# Altium schematic sheet LED.SchDoc: LEDs
size A; Revision: 1
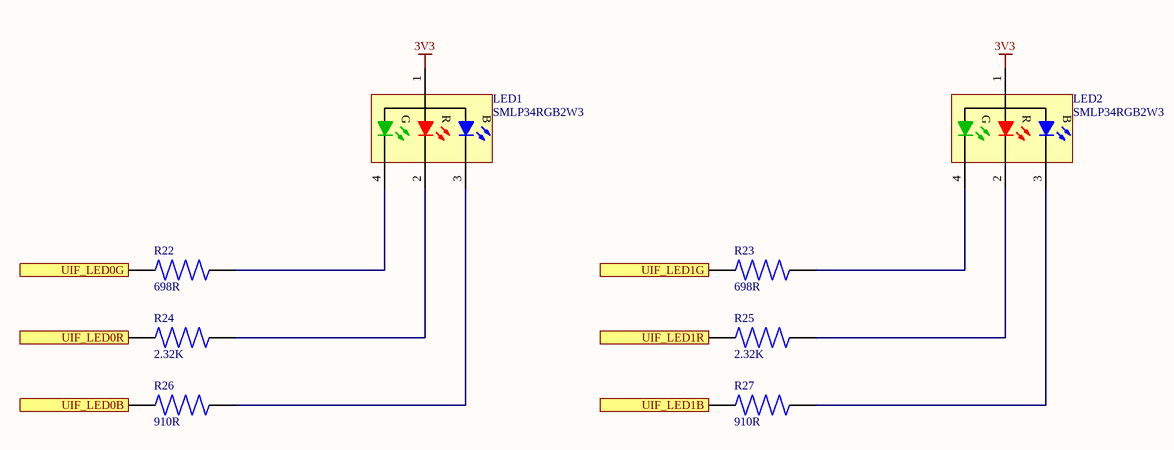
[diagram p0: LED.SchDoc]

## Parts
LED1  SMLP34RGB2W3  [ROHM-SMLP34-4_V]
LED2  SMLP34RGB2W3  [ROHM-SMLP34-4_V]
R22  698R  [R0603 Vishay]
R23  698R  [R0603 Vishay]
R24  2.32K  [R0805 Vishay]
R25  2.32K  [R0805 Vishay]
R26  910R  [R0402 Vishay]
R27  910R  [R0402 Vishay]

## Ports
UIF_LED0B (in), UIF_LED0G (in), UIF_LED0R (in), UIF_LED1B (in), UIF_LED1G (in), UIF_LED1R (in)

## Nets
3V3: LED1.1(A) LED2.1(A)
UIF_LED0B: R26.1 ; port UIF_LED0B
UIF_LED0G: R22.1 ; port UIF_LED0G
UIF_LED0R: R24.1 ; port UIF_LED0R
UIF_LED1B: R27.1 ; port UIF_LED1B
UIF_LED1G: R23.1 ; port UIF_LED1G
UIF_LED1R: R25.1 ; port UIF_LED1R
NetLED1_2: LED1.2(R) R24.2
NetLED1_3: LED1.3(B) R26.2
NetLED1_4: LED1.4(G) R22.2
NetLED2_2: LED2.2(R) R25.2
NetLED2_3: LED2.3(B) R27.2
NetLED2_4: LED2.4(G) R23.2

## Library data of the parts
LED1 LED2 = SMLP34RGB2W3: PICOLED-RGB LED, 5 mA, -40 to 85 degC, 4-Pin 1 x 1 x 0.25 mm SMD, RoHS, Tape and Reel; Manufacturer: ROHM Semiconductor; VR(RGB): 5 V; VF(Blue): 3.2 V Typ.; VF(Green): 3.3 V Typ.; IF(RGB): 5 mA; IR(RGB): 10 uA Max.; VF(Red): 2.2 V Typ.; ComponentLink1Description: Manufacturer URL; ComponentLink2Description: Datasheet; PartNumber: SMLP34RGB2W3; DatasheetVersion: Rev. G; Mounting Technology: Surface Mount; ComponentLink1URL: http://www.rohm.com/; Packing: Tape and Reel; RoHS: TRUE; Temperature Range: -40 to 85 degC; PackageReference: SMLP34; PackageDescription: 4-Pin SMD, Body 1 x 1 mm, Pitch 0.85 mm; ComponentLink2URL: http://rohmfs.rohm.com/en/products/databook/datasheet/opto/led/chip_multi/smlp34.pdf
R22 R23 = CRCW0201698RFNED: RES SMD 698 OHM 1% 1/20W 0201; Manufacturer: Vishay; Power Rating: 50mW; Voltage Rating: 30V; Temperature Coefficient: 200ppm/°C; Supplier 1: Digi-Key; Manufacturer Part Number: CRCW0201698RFNED; RoHS: Yes; Category: Chip SMD Resistors; Stock 1: 10000; Pricing 1: 1=0.10000, 10=0.05700, 100=0.02300, 1000=0.01034, 2500=0.00897, 5000=0.00741 (USD); Case/Package: 0201; Case Code (Metric): 0603; Case Code (Imperial): 0201; Contact Plating: Tin; Min Operating Temperature: -55°C; Max Operating Temperature: 155°C; Packaging: Tape and Reel; Resistance: 698R; Tolerance: 1%; Package Quantity: 10000; Resistor Type: Thick Film; Number of Terminations: 2; Max Power Dissipation: 50mW; Voltage Rating (DC): 30V; Length: 0.024inch; Width: 0.012inch; Height: 0.011inch; Radiation Hardening: No; REACH SVHC: Unknown; Lead Free: Lead Free; ComponentLink1URL: https://datasheet.ciiva.com/2577/crcw0201e3-2577171.pdf?src-supplier=Digi-Key; ComponentLink1Description: https://datasheet.ciiva.com/2577/crcw0201e3-2577171.pdf?src-supplier=Digi-Key; ComponentLink2URL: https://datasheet.ciiva.com/8922/crcw0201e3-8922646.pdf?src-supplier=Avnet; ComponentLink2Description: https://datasheet.ciiva.com/8922/crcw0201e3-8922646.pdf?src-supplier=Avnet; ComponentLink3URL: https://datasheet.ciiva.com/7672/1719906-7672440.pdf?src-supplier=Element14; ComponentLink3Description: https://datasheet.ciiva.com/7672/1719906-7672440.pdf?src-supplier=Element14; ComponentLink4URL: https://datasheet.ciiva.com/7672/1719906-7672441.pdf?src-supplier=Element14; ComponentLink4Description: https://datasheet.ciiva.com/7672/1719906-7672441.pdf?src-supplier=Element14; ComponentLink5URL: https://datasheet.ciiva.com/22674/1700795-22674828.pdf?src-supplier=Element14; ComponentLink5Description: https://datasheet.ciiva.com/22674/1700795-22674828.pdf?src-supplier=Element14; Supplier Part Number 1: 541-CRCW0201698RFNEDCT-ND
R24 R25 = CRCW08052K32FKEA: VISHAY - CRCW08052K32FKEA - RES, THICK FILM, 2K32, 1%, 0.125W, 0805; Resistance: 2.32kR; Temperature Coefficient: 100ppm/°C; Max Power Dissipation: 125mW; Voltage Rating: 150V; Supplier 1: Digi-Key; Manufacturer: Vishay; Manufacturer Part Number: CRCW08052K32FKEA; RoHS: Yes; Category: Chip SMD Resistors; Stock 1: 20040; Pricing 1: 1=0.10000, 10=0.05700, 100=0.02310, 1000=0.01039, 2500=0.00902 (USD); Case/Package: 0805; Number of Pins: 2; Contact Plating: Tin; Weight: 0.000194oz; Case Code (Imperial): 0805; Case Code (Metric): 2012; Min Operating Temperature: -55°C; Max Operating Temperature: 155°C; Tolerance: 1%; Resistor Type: Thick Film; Packaging: Tape and Reel; Number of Terminations: 2; Package Quantity: 10; Features: Automotive AEC-Q200; Power Rating: 125mW; Termination: SMD/SMT; Voltage Rating (DC): 150V; Length: 2mm; Width: 1.25mm; Height: 0.02inch; Depth: 1.25mm; Radiation Hardening: No; Lead Free: Lead Free; REACH SVHC: Unknown; Military Standard: Not; ComponentLink1URL: https://datasheet.ciiva.com/16435/dcrcwe3-16435909.pdf?src-supplier=Future+Electronics; ComponentLink1Description: https://datasheet.ciiva.com/16435/dcrcwe3-16435909.pdf?src-supplier=Future+Electronics; ComponentLink2URL: https://datasheet.ciiva.com/3258/dcrcwe3-3258438.pdf?src-supplier=Avnet; ComponentLink2Description: https://datasheet.ciiva.com/3258/dcrcwe3-3258438.pdf?src-supplier=Avnet; ComponentLink3URL: https://datasheet.ciiva.com/3258/dcrcwe3-3258439.pdf?src-supplier=Avnet; ComponentLink3Description: https://datasheet.ciiva.com/3258/dcrcwe3-3258439.pdf?src-supplier=Avnet; ComponentLink4URL: https://datasheet.ciiva.com/2525/dcrcwe3-2525755.pdf?src-supplier=Digi-Key; ComponentLink4Description: https://datasheet.ciiva.com/2525/dcrcwe3-2525755.pdf?src-supplier=Digi-Key; ComponentLink5URL: https://datasheet.ciiva.com/2525/dcrcwe3-2525756.pdf?src-supplier=Digi-Key; ComponentLink5Description: https://datasheet.ciiva.com/2525/dcrcwe3-2525756.pdf?src-supplier=Digi-Key; ComponentLink6URL: https://datasheet.ciiva.com/2525/dcrcwe3-2525757.pdf?src-supplier=Digi-Key; ComponentLink6Description: https://datasheet.ciiva.com/2525/dcrcwe3-2525757.pdf?src-supplier=Digi-Key; ComponentLink7URL: https://datasheet.ciiva.com/7670/1697337-7670286.pdf?src-supplier=Element14; ComponentLink7Description: https://datasheet.ciiva.com/7670/1697337-7670286.pdf?src-supplier=Element14; ComponentLink8URL: https://datasheet.ciiva.com/17201/dcrcwe3-17201132.pdf?src-supplier=Avnet+Europe; ComponentLink8Description: https://datasheet.ciiva.com/17201/dcrcwe3-17201132.pdf?src-supplier=Avnet+Europe; ComponentLink9URL: https://datasheet.ciiva.com/7670/1697337-7670285.pdf?src-supplier=Element14; ComponentLink9Description: https://datasheet.ciiva.com/7670/1697337-7670285.pdf?src-supplier=Element14; ComponentLink10URL: https://datasheet.ciiva.com/22675/1825492-22675197.pdf?src-supplier=Element14; ComponentLink10Description: https://datasheet.ciiva.com/22675/1825492-22675197.pdf?src-supplier=Element14; ComponentLink11URL: https://datasheet.ciiva.com/16769/70201119-16769374.pdf?src-supplier=Allied+Electronics; ComponentLink11Description: https://datasheet.ciiva.com/16769/70201119-16769374.pdf?src-supplier=Allied+Electronics; Supplier Part Number 1: 541-2.32KCCT-ND
R26 R27 = CRCW0402910RFKED: Res Thick Film 0402 910 Ohm 1% 0.063W(1/16W) ±100ppm/C Pad SMD Automotive T/R; Manufacturer: Vishay; Temperature Coefficient: 100ppm/°C; Power Rating: 63mW; Voltage Rating: 50V; Supplier 1: Digi-Key; Manufacturer Part Number: CRCW0402910RFKED; RoHS: Yes; Category: Chip SMD Resistors; Stock 1: 32719; Pricing 1: 1=0.10000, 10=0.03300, 100=0.01330, 1000=0.00596, 2500=0.00518, 5000=0.00428 (USD); Case/Package: 0402; Contact Plating: Tin; Weight: 2.3E-05oz; Case Code (Imperial): 0402; Case Code (Metric): 1005; Min Operating Temperature: -55°C; Max Operating Temperature: 155°C; Resistance: 910R; Tolerance: 1%; Resistor Type: Thick Film; Packaging: Tape and Reel; Package Quantity: 10; Termination: SMD/SMT; Number of Terminations: 2; Max Power Dissipation: 63mW; Features: Automotive AEC-Q200; Voltage Rating (DC): 50V; Length: 1mm; Width: 0.5mm; Height: 0.35mm; Depth: 0.5mm; Radiation Hardening: No; Lead Free: Lead Free; REACH SVHC: Unknown; Military Standard: Not; ComponentLink1URL: https://datasheet.ciiva.com/11818/0900766b80d98824-11818156.pdf?src-supplier=RSComponents; ComponentLink1Description: https://datasheet.ciiva.com/11818/0900766b80d98824-11818156.pdf?src-supplier=RSComponents; ComponentLink2URL: https://datasheet.ciiva.com/5545/dcrcwe3-109170-5545657.pdf?src-supplier=Mouser; ComponentLink2Description: https://datasheet.ciiva.com/5545/dcrcwe3-109170-5545657.pdf?src-supplier=Mouser; ComponentLink3URL: https://datasheet.ciiva.com/22674/1847332-22674841.pdf?src-supplier=Element14; ComponentLink3Description: https://datasheet.ciiva.com/22674/1847332-22674841.pdf?src-supplier=Element14; ComponentLink4URL: https://datasheet.ciiva.com/2463/dcrcwe3-2463999.pdf?src-supplier=Digi-Key; ComponentLink4Description: https://datasheet.ciiva.com/2463/dcrcwe3-2463999.pdf?src-supplier=Digi-Key; ComponentLink5URL: https://datasheet.ciiva.com/7672/1697337-7672517.pdf?src-supplier=Element14; ComponentLink5Description: https://datasheet.ciiva.com/7672/1697337-7672517.pdf?src-supplier=Element14; ComponentLink6URL: https://datasheet.ciiva.com/16778/70201119-16778533.pdf?src-supplier=Allied+Electronics; ComponentLink6Description: https://datasheet.ciiva.com/16778/70201119-16778533.pdf?src-supplier=Allied+Electronics; ComponentLink7URL: https://datasheet.ciiva.com/16426/dcrcwe3-16426299.pdf?src-supplier=Future+Electronics; ComponentLink7Description: https://datasheet.ciiva.com/16426/dcrcwe3-16426299.pdf?src-supplier=Future+Electronics; ComponentLink8URL: https://datasheet.ciiva.com/22706/1697337-22706347.pdf?src-supplier=Element14; ComponentLink8Description: https://datasheet.ciiva.com/22706/1697337-22706347.pdf?src-supplier=Element14; ComponentLink9URL: https://datasheet.ciiva.com/2463/dcrcwe3-2463997.pdf?src-supplier=Digi-Key; ComponentLink9Description: https://datasheet.ciiva.com/2463/dcrcwe3-2463997.pdf?src-supplier=Digi-Key; ComponentLink10URL: https://datasheet.ciiva.com/2463/dcrcwe3-2463998.pdf?src-supplier=Digi-Key; ComponentLink10Description: https://datasheet.ciiva.com/2463/dcrcwe3-2463998.pdf?src-supplier=Digi-Key; ComponentLink11URL: https://datasheet.ciiva.com/7672/1697337-7672518.pdf?src-supplier=Element14; ComponentLink11Description: https://datasheet.ciiva.com/7672/1697337-7672518.pdf?src-supplier=Element14; Supplier Part Number 1: 541-910LCT-ND